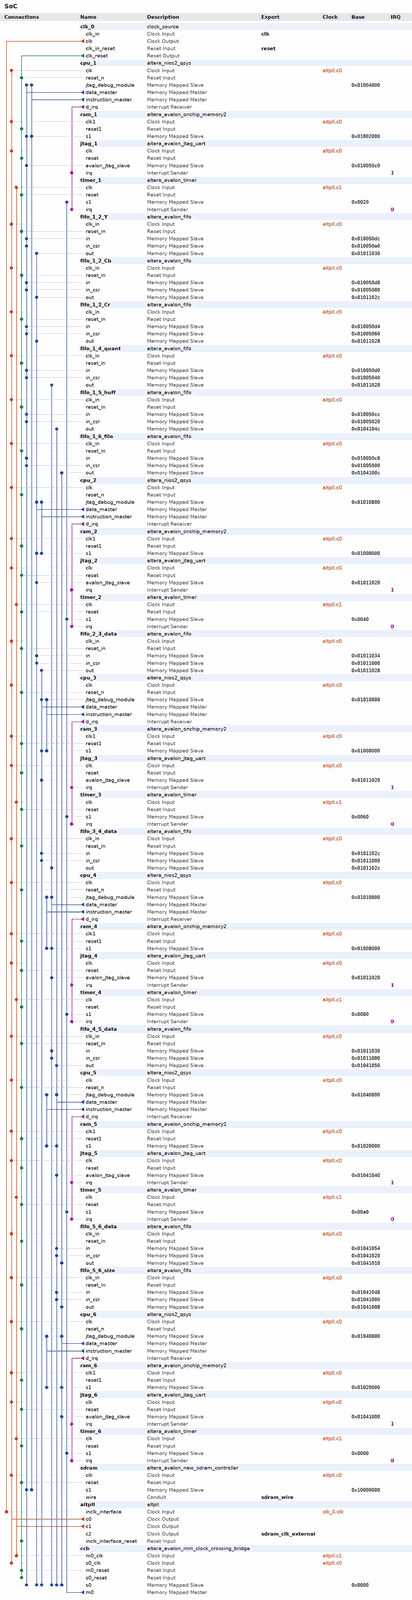
[diagram p0: system contents, whole]
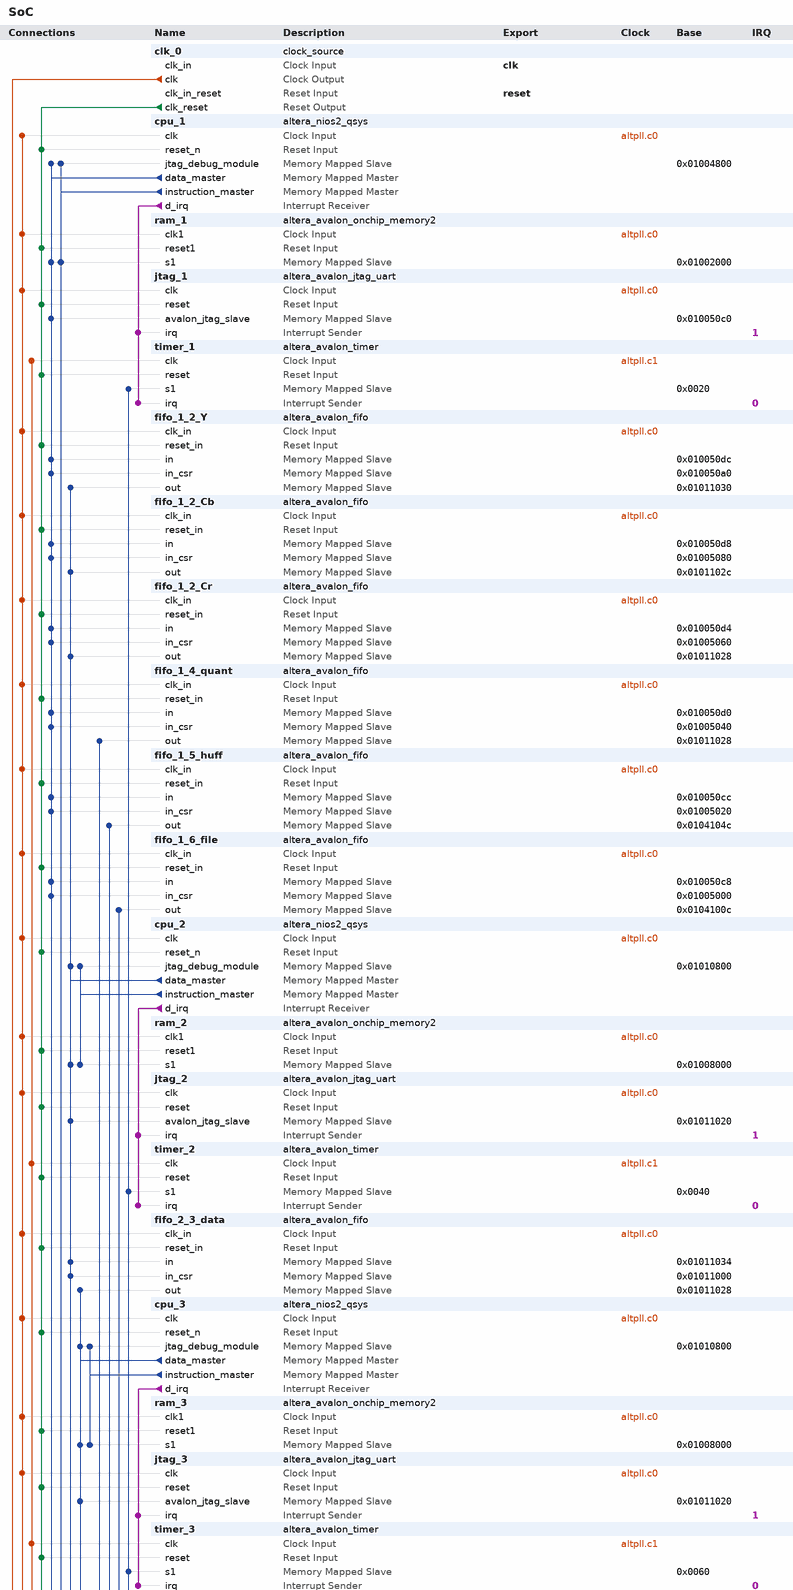
[diagram p1: system contents, upper part]
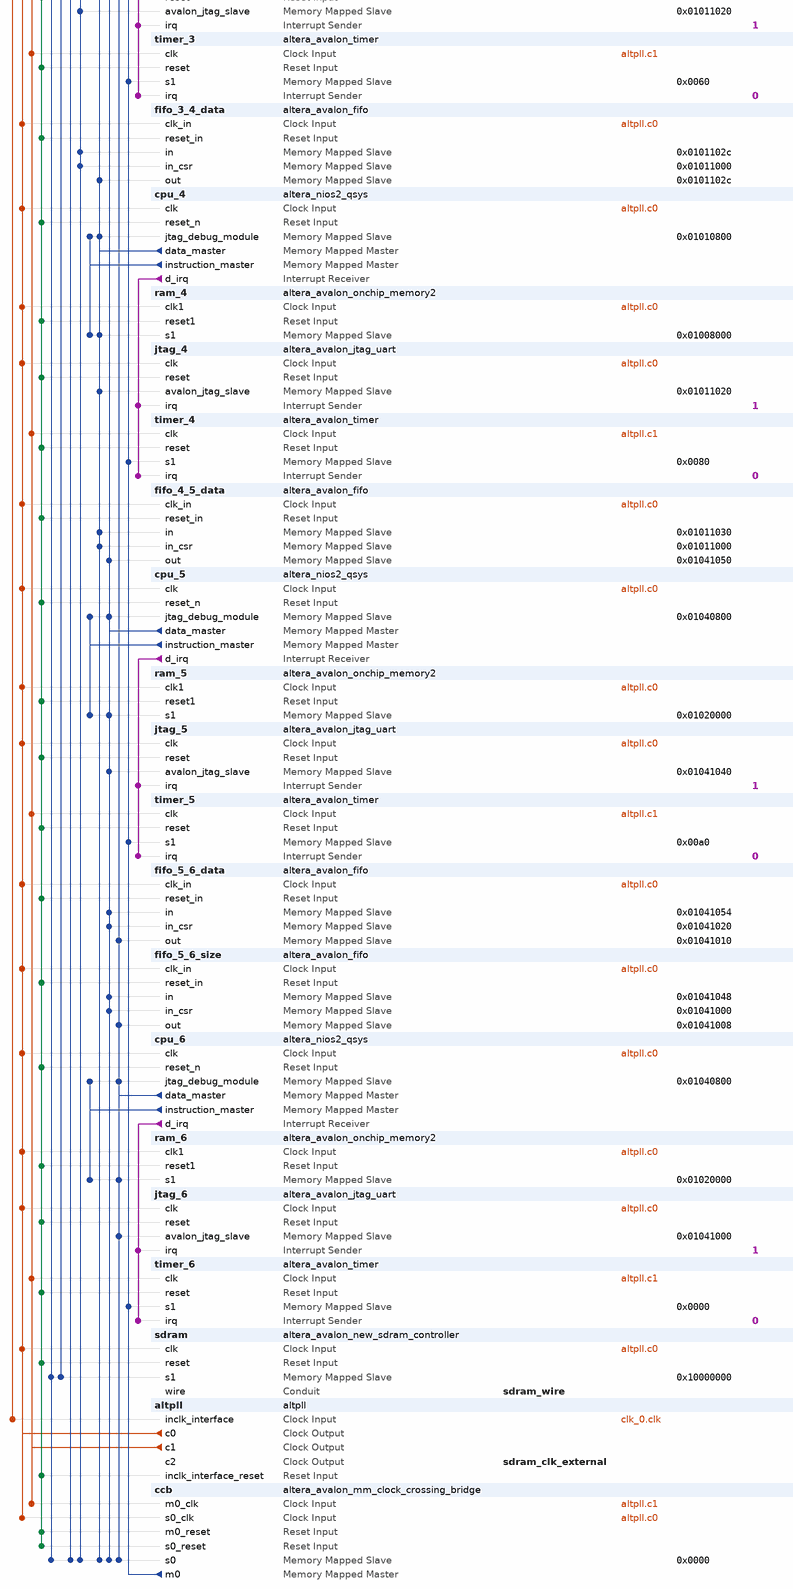
[diagram p2: system contents, lower part]
# Platform Designer (Qsys) system SoC, Cyclone IV E EP4CE115F29C7
# Parameters at their usual value, and those the tool derives, are not listed.
package require -exact qsys 13.1
create_system SoC
set_project_property DEVICE_FAMILY {Cyclone IV E}
set_project_property DEVICE EP4CE115F29C7

add_instance clk_0 clock_source 13.1
set_instance_parameter_value clk_0 clockFrequency 50000000

add_instance cpu_1 altera_nios2_qsys 13.1
set_instance_parameter_value cpu_1 resetSlave sdram.s1
set_instance_parameter_value cpu_1 mmu_TLBMissExcSlave None
set_instance_parameter_value cpu_1 exceptionSlave sdram.s1
set_instance_parameter_value cpu_1 breakSlave cpu_1.jtag_debug_module
set_instance_parameter_value cpu_1 impl Tiny
set_instance_parameter_value cpu_1 icache_size 4096

add_instance ram_1 altera_avalon_onchip_memory2 13.1
set_instance_parameter_value ram_1 dataWidth 32
set_instance_parameter_value ram_1 dualPort false
set_instance_parameter_value ram_1 initMemContent true
set_instance_parameter_value ram_1 initializationFileName onchip_mem.hex
set_instance_parameter_value ram_1 memorySize 8192

add_instance jtag_1 altera_avalon_jtag_uart 13.1
set_instance_parameter_value jtag_1 simInteractiveOptions NO_INTERACTIVE_WINDOWS

add_instance timer_1 altera_avalon_timer 13.1
set_instance_parameter_value timer_1 period 1
set_instance_parameter_value timer_1 periodUnits MSEC

add_instance fifo_1_2_Y altera_avalon_fifo 13.1
set_instance_parameter_value fifo_1_2_Y bitsPerSymbol 16
set_instance_parameter_value fifo_1_2_Y channelWidth 8
set_instance_parameter_value fifo_1_2_Y errorWidth 8
set_instance_parameter_value fifo_1_2_Y fifoDepth 128
set_instance_parameter_value fifo_1_2_Y fifoInputInterfaceOptions AVALONMM_WRITE
set_instance_parameter_value fifo_1_2_Y fifoOutputInterfaceOptions AVALONMM_READ
set_instance_parameter_value fifo_1_2_Y singleClockMode true
set_instance_parameter_value fifo_1_2_Y symbolsPerBeat 2
set_instance_parameter_value fifo_1_2_Y useIRQ false
set_instance_parameter_value fifo_1_2_Y usePacket true
set_instance_parameter_value fifo_1_2_Y useReadControl false

add_instance fifo_1_2_Cb altera_avalon_fifo 13.1
set_instance_parameter_value fifo_1_2_Cb bitsPerSymbol 16
set_instance_parameter_value fifo_1_2_Cb channelWidth 8
set_instance_parameter_value fifo_1_2_Cb errorWidth 8
set_instance_parameter_value fifo_1_2_Cb fifoDepth 128
set_instance_parameter_value fifo_1_2_Cb fifoInputInterfaceOptions AVALONMM_WRITE
set_instance_parameter_value fifo_1_2_Cb fifoOutputInterfaceOptions AVALONMM_READ
set_instance_parameter_value fifo_1_2_Cb singleClockMode true
set_instance_parameter_value fifo_1_2_Cb symbolsPerBeat 2
set_instance_parameter_value fifo_1_2_Cb useIRQ false
set_instance_parameter_value fifo_1_2_Cb usePacket true
set_instance_parameter_value fifo_1_2_Cb useReadControl false

add_instance fifo_1_2_Cr altera_avalon_fifo 13.1
set_instance_parameter_value fifo_1_2_Cr bitsPerSymbol 16
set_instance_parameter_value fifo_1_2_Cr channelWidth 8
set_instance_parameter_value fifo_1_2_Cr errorWidth 8
set_instance_parameter_value fifo_1_2_Cr fifoDepth 128
set_instance_parameter_value fifo_1_2_Cr fifoInputInterfaceOptions AVALONMM_WRITE
set_instance_parameter_value fifo_1_2_Cr fifoOutputInterfaceOptions AVALONMM_READ
set_instance_parameter_value fifo_1_2_Cr singleClockMode true
set_instance_parameter_value fifo_1_2_Cr symbolsPerBeat 2
set_instance_parameter_value fifo_1_2_Cr useIRQ false
set_instance_parameter_value fifo_1_2_Cr usePacket true
set_instance_parameter_value fifo_1_2_Cr useReadControl false

add_instance fifo_1_4_quant altera_avalon_fifo 13.1
set_instance_parameter_value fifo_1_4_quant bitsPerSymbol 16
set_instance_parameter_value fifo_1_4_quant channelWidth 8
set_instance_parameter_value fifo_1_4_quant errorWidth 8
set_instance_parameter_value fifo_1_4_quant fifoDepth 128
set_instance_parameter_value fifo_1_4_quant fifoInputInterfaceOptions AVALONMM_WRITE
set_instance_parameter_value fifo_1_4_quant fifoOutputInterfaceOptions AVALONMM_READ
set_instance_parameter_value fifo_1_4_quant singleClockMode true
set_instance_parameter_value fifo_1_4_quant symbolsPerBeat 2
set_instance_parameter_value fifo_1_4_quant useIRQ false
set_instance_parameter_value fifo_1_4_quant usePacket true
set_instance_parameter_value fifo_1_4_quant useReadControl false

add_instance fifo_1_5_huff altera_avalon_fifo 13.1
set_instance_parameter_value fifo_1_5_huff bitsPerSymbol 16
set_instance_parameter_value fifo_1_5_huff channelWidth 8
set_instance_parameter_value fifo_1_5_huff errorWidth 8
set_instance_parameter_value fifo_1_5_huff fifoDepth 128
set_instance_parameter_value fifo_1_5_huff fifoInputInterfaceOptions AVALONMM_WRITE
set_instance_parameter_value fifo_1_5_huff fifoOutputInterfaceOptions AVALONMM_READ
set_instance_parameter_value fifo_1_5_huff singleClockMode true
set_instance_parameter_value fifo_1_5_huff symbolsPerBeat 2
set_instance_parameter_value fifo_1_5_huff useIRQ false
set_instance_parameter_value fifo_1_5_huff usePacket true
set_instance_parameter_value fifo_1_5_huff useReadControl false

add_instance fifo_1_6_file altera_avalon_fifo 13.1
set_instance_parameter_value fifo_1_6_file bitsPerSymbol 16
set_instance_parameter_value fifo_1_6_file channelWidth 8
set_instance_parameter_value fifo_1_6_file errorWidth 8
set_instance_parameter_value fifo_1_6_file fifoDepth 128
set_instance_parameter_value fifo_1_6_file fifoInputInterfaceOptions AVALONMM_WRITE
set_instance_parameter_value fifo_1_6_file fifoOutputInterfaceOptions AVALONMM_READ
set_instance_parameter_value fifo_1_6_file singleClockMode true
set_instance_parameter_value fifo_1_6_file symbolsPerBeat 2
set_instance_parameter_value fifo_1_6_file useIRQ false
set_instance_parameter_value fifo_1_6_file usePacket true
set_instance_parameter_value fifo_1_6_file useReadControl false

add_instance cpu_2 altera_nios2_qsys 13.1
set_instance_parameter_value cpu_2 resetSlave ram_2.s1
set_instance_parameter_value cpu_2 mmu_TLBMissExcSlave None
set_instance_parameter_value cpu_2 exceptionSlave ram_2.s1
set_instance_parameter_value cpu_2 breakSlave cpu_2.jtag_debug_module
set_instance_parameter_value cpu_2 impl Tiny
set_instance_parameter_value cpu_2 icache_size 4096

add_instance ram_2 altera_avalon_onchip_memory2 13.1
set_instance_parameter_value ram_2 dataWidth 32
set_instance_parameter_value ram_2 dualPort false
set_instance_parameter_value ram_2 initMemContent true
set_instance_parameter_value ram_2 initializationFileName onchip_mem.hex
set_instance_parameter_value ram_2 memorySize 32768

add_instance jtag_2 altera_avalon_jtag_uart 13.1
set_instance_parameter_value jtag_2 simInteractiveOptions NO_INTERACTIVE_WINDOWS

add_instance timer_2 altera_avalon_timer 13.1
set_instance_parameter_value timer_2 period 1
set_instance_parameter_value timer_2 periodUnits MSEC

add_instance fifo_2_3_data altera_avalon_fifo 13.1
set_instance_parameter_value fifo_2_3_data bitsPerSymbol 16
set_instance_parameter_value fifo_2_3_data channelWidth 8
set_instance_parameter_value fifo_2_3_data errorWidth 8
set_instance_parameter_value fifo_2_3_data fifoDepth 128
set_instance_parameter_value fifo_2_3_data fifoInputInterfaceOptions AVALONMM_WRITE
set_instance_parameter_value fifo_2_3_data fifoOutputInterfaceOptions AVALONMM_READ
set_instance_parameter_value fifo_2_3_data singleClockMode true
set_instance_parameter_value fifo_2_3_data symbolsPerBeat 2
set_instance_parameter_value fifo_2_3_data useIRQ false
set_instance_parameter_value fifo_2_3_data usePacket true
set_instance_parameter_value fifo_2_3_data useReadControl false

add_instance cpu_3 altera_nios2_qsys 13.1
set_instance_parameter_value cpu_3 muldiv_divider true
set_instance_parameter_value cpu_3 resetSlave ram_3.s1
set_instance_parameter_value cpu_3 mmu_TLBMissExcSlave None
set_instance_parameter_value cpu_3 exceptionSlave ram_3.s1
set_instance_parameter_value cpu_3 breakSlave cpu_3.jtag_debug_module
set_instance_parameter_value cpu_3 impl Tiny
set_instance_parameter_value cpu_3 icache_size 4096

add_instance ram_3 altera_avalon_onchip_memory2 13.1
set_instance_parameter_value ram_3 dataWidth 32
set_instance_parameter_value ram_3 dualPort false
set_instance_parameter_value ram_3 initMemContent true
set_instance_parameter_value ram_3 initializationFileName onchip_mem.hex
set_instance_parameter_value ram_3 memorySize 32768

add_instance jtag_3 altera_avalon_jtag_uart 13.1
set_instance_parameter_value jtag_3 simInteractiveOptions NO_INTERACTIVE_WINDOWS

add_instance timer_3 altera_avalon_timer 13.1
set_instance_parameter_value timer_3 period 1
set_instance_parameter_value timer_3 periodUnits MSEC

add_instance fifo_3_4_data altera_avalon_fifo 13.1
set_instance_parameter_value fifo_3_4_data bitsPerSymbol 16
set_instance_parameter_value fifo_3_4_data channelWidth 8
set_instance_parameter_value fifo_3_4_data errorWidth 8
set_instance_parameter_value fifo_3_4_data fifoDepth 128
set_instance_parameter_value fifo_3_4_data fifoInputInterfaceOptions AVALONMM_WRITE
set_instance_parameter_value fifo_3_4_data fifoOutputInterfaceOptions AVALONMM_READ
set_instance_parameter_value fifo_3_4_data singleClockMode true
set_instance_parameter_value fifo_3_4_data symbolsPerBeat 2
set_instance_parameter_value fifo_3_4_data useIRQ false
set_instance_parameter_value fifo_3_4_data usePacket true
set_instance_parameter_value fifo_3_4_data useReadControl false

add_instance cpu_4 altera_nios2_qsys 13.1
set_instance_parameter_value cpu_4 muldiv_divider true
set_instance_parameter_value cpu_4 resetSlave ram_4.s1
set_instance_parameter_value cpu_4 mmu_TLBMissExcSlave None
set_instance_parameter_value cpu_4 exceptionSlave ram_4.s1
set_instance_parameter_value cpu_4 breakSlave cpu_4.jtag_debug_module
set_instance_parameter_value cpu_4 impl Tiny
set_instance_parameter_value cpu_4 icache_size 4096

add_instance ram_4 altera_avalon_onchip_memory2 13.1
set_instance_parameter_value ram_4 dataWidth 32
set_instance_parameter_value ram_4 dualPort false
set_instance_parameter_value ram_4 initMemContent true
set_instance_parameter_value ram_4 initializationFileName onchip_mem.hex
set_instance_parameter_value ram_4 memorySize 32768

add_instance jtag_4 altera_avalon_jtag_uart 13.1
set_instance_parameter_value jtag_4 simInteractiveOptions NO_INTERACTIVE_WINDOWS

add_instance timer_4 altera_avalon_timer 13.1
set_instance_parameter_value timer_4 period 1
set_instance_parameter_value timer_4 periodUnits MSEC

add_instance fifo_4_5_data altera_avalon_fifo 13.1
set_instance_parameter_value fifo_4_5_data bitsPerSymbol 16
set_instance_parameter_value fifo_4_5_data channelWidth 8
set_instance_parameter_value fifo_4_5_data errorWidth 8
set_instance_parameter_value fifo_4_5_data fifoDepth 128
set_instance_parameter_value fifo_4_5_data fifoInputInterfaceOptions AVALONMM_WRITE
set_instance_parameter_value fifo_4_5_data fifoOutputInterfaceOptions AVALONMM_READ
set_instance_parameter_value fifo_4_5_data singleClockMode true
set_instance_parameter_value fifo_4_5_data symbolsPerBeat 2
set_instance_parameter_value fifo_4_5_data useIRQ false
set_instance_parameter_value fifo_4_5_data usePacket true
set_instance_parameter_value fifo_4_5_data useReadControl false

add_instance cpu_5 altera_nios2_qsys 13.1
set_instance_parameter_value cpu_5 resetSlave ram_5.s1
set_instance_parameter_value cpu_5 mmu_TLBMissExcSlave None
set_instance_parameter_value cpu_5 exceptionSlave ram_5.s1
set_instance_parameter_value cpu_5 breakSlave cpu_5.jtag_debug_module
set_instance_parameter_value cpu_5 impl Tiny
set_instance_parameter_value cpu_5 icache_size 4096

add_instance ram_5 altera_avalon_onchip_memory2 13.1
set_instance_parameter_value ram_5 dataWidth 32
set_instance_parameter_value ram_5 dualPort false
set_instance_parameter_value ram_5 initMemContent true
set_instance_parameter_value ram_5 initializationFileName onchip_mem.hex
set_instance_parameter_value ram_5 memorySize 131072

add_instance jtag_5 altera_avalon_jtag_uart 13.1
set_instance_parameter_value jtag_5 simInteractiveOptions NO_INTERACTIVE_WINDOWS

add_instance timer_5 altera_avalon_timer 13.1
set_instance_parameter_value timer_5 period 1
set_instance_parameter_value timer_5 periodUnits MSEC

add_instance fifo_5_6_data altera_avalon_fifo 13.1
set_instance_parameter_value fifo_5_6_data bitsPerSymbol 16
set_instance_parameter_value fifo_5_6_data channelWidth 8
set_instance_parameter_value fifo_5_6_data errorWidth 8
set_instance_parameter_value fifo_5_6_data fifoDepth 128
set_instance_parameter_value fifo_5_6_data fifoInputInterfaceOptions AVALONMM_WRITE
set_instance_parameter_value fifo_5_6_data fifoOutputInterfaceOptions AVALONMM_READ
set_instance_parameter_value fifo_5_6_data singleClockMode true
set_instance_parameter_value fifo_5_6_data symbolsPerBeat 2
set_instance_parameter_value fifo_5_6_data useIRQ false
set_instance_parameter_value fifo_5_6_data usePacket true
set_instance_parameter_value fifo_5_6_data useReadControl false

add_instance fifo_5_6_size altera_avalon_fifo 13.1
set_instance_parameter_value fifo_5_6_size bitsPerSymbol 16
set_instance_parameter_value fifo_5_6_size channelWidth 8
set_instance_parameter_value fifo_5_6_size errorWidth 8
set_instance_parameter_value fifo_5_6_size fifoDepth 128
set_instance_parameter_value fifo_5_6_size fifoInputInterfaceOptions AVALONMM_WRITE
set_instance_parameter_value fifo_5_6_size fifoOutputInterfaceOptions AVALONMM_READ
set_instance_parameter_value fifo_5_6_size singleClockMode true
set_instance_parameter_value fifo_5_6_size symbolsPerBeat 2
set_instance_parameter_value fifo_5_6_size useIRQ false
set_instance_parameter_value fifo_5_6_size usePacket true
set_instance_parameter_value fifo_5_6_size useReadControl false

add_instance cpu_6 altera_nios2_qsys 13.1
set_instance_parameter_value cpu_6 resetSlave ram_6.s1
set_instance_parameter_value cpu_6 mmu_TLBMissExcSlave None
set_instance_parameter_value cpu_6 exceptionSlave ram_6.s1
set_instance_parameter_value cpu_6 breakSlave cpu_6.jtag_debug_module
set_instance_parameter_value cpu_6 impl Tiny
set_instance_parameter_value cpu_6 icache_size 4096

add_instance ram_6 altera_avalon_onchip_memory2 13.1
set_instance_parameter_value ram_6 dataWidth 32
set_instance_parameter_value ram_6 dualPort false
set_instance_parameter_value ram_6 initMemContent true
set_instance_parameter_value ram_6 initializationFileName onchip_mem.hex
set_instance_parameter_value ram_6 memorySize 131072

add_instance jtag_6 altera_avalon_jtag_uart 13.1
set_instance_parameter_value jtag_6 simInteractiveOptions NO_INTERACTIVE_WINDOWS

add_instance timer_6 altera_avalon_timer 13.1
set_instance_parameter_value timer_6 period 1
set_instance_parameter_value timer_6 periodUnits MSEC

add_instance sdram altera_avalon_new_sdram_controller 13.1
set_instance_parameter_value sdram TAC 6.0
set_instance_parameter_value sdram TRCD 20.0
set_instance_parameter_value sdram TRP 20.0
set_instance_parameter_value sdram casLatency 3
set_instance_parameter_value sdram columnWidth 10
set_instance_parameter_value sdram dataWidth 32
set_instance_parameter_value sdram generateSimulationModel false
set_instance_parameter_value sdram model single_Micron_MT48LC4M32B2_7_chip
set_instance_parameter_value sdram numberOfBanks 4
set_instance_parameter_value sdram numberOfChipSelects 1
set_instance_parameter_value sdram powerUpDelay 100.0
set_instance_parameter_value sdram refreshPeriod 15.625
set_instance_parameter_value sdram rowWidth 13

add_instance altpll altpll 13.1
set_instance_parameter_value altpll INCLK0_INPUT_FREQUENCY 20000
set_instance_parameter_value altpll CLK0_MULTIPLY_BY 2
set_instance_parameter_value altpll CLK1_MULTIPLY_BY 1
set_instance_parameter_value altpll CLK2_MULTIPLY_BY 2
set_instance_parameter_value altpll CLK0_DIVIDE_BY 1
set_instance_parameter_value altpll CLK1_DIVIDE_BY 5
set_instance_parameter_value altpll CLK2_DIVIDE_BY 1
set_instance_parameter_value altpll CLK1_PHASE_SHIFT 0
set_instance_parameter_value altpll CLK2_PHASE_SHIFT -1806
set_instance_parameter_value altpll CLK1_DUTY_CYCLE 50
set_instance_parameter_value altpll CLK2_DUTY_CYCLE 50
set_instance_parameter_value altpll PORT_clk1 PORT_USED
set_instance_parameter_value altpll PORT_clk2 PORT_USED
set_instance_parameter_value altpll PORT_clk3 PORT_UNUSED
set_instance_parameter_value altpll PORT_ARESET PORT_UNUSED
set_instance_parameter_value altpll PORT_LOCKED PORT_UNUSED

add_instance ccb altera_avalon_mm_clock_crossing_bridge 13.1
set_instance_parameter_value ccb DATA_WIDTH 32
set_instance_parameter_value ccb ADDRESS_WIDTH 16
set_instance_parameter_value ccb MAX_BURST_SIZE 1
set_instance_parameter_value ccb COMMAND_FIFO_DEPTH 4
set_instance_parameter_value ccb RESPONSE_FIFO_DEPTH 4
set_instance_parameter_value ccb MASTER_SYNC_DEPTH 2
set_instance_parameter_value ccb SLAVE_SYNC_DEPTH 2

# connections
add_connection altpll.c0 ccb.s0_clk clock
add_connection altpll.c0 cpu_1.clk clock
add_connection altpll.c0 cpu_2.clk clock
add_connection altpll.c0 cpu_3.clk clock
add_connection altpll.c0 cpu_4.clk clock
add_connection altpll.c0 cpu_5.clk clock
add_connection altpll.c0 cpu_6.clk clock
add_connection altpll.c0 fifo_1_2_Cb.clk_in clock
add_connection altpll.c0 fifo_1_2_Cr.clk_in clock
add_connection altpll.c0 fifo_1_2_Y.clk_in clock
add_connection altpll.c0 fifo_1_4_quant.clk_in clock
add_connection altpll.c0 fifo_1_5_huff.clk_in clock
add_connection altpll.c0 fifo_1_6_file.clk_in clock
add_connection altpll.c0 fifo_2_3_data.clk_in clock
add_connection altpll.c0 fifo_3_4_data.clk_in clock
add_connection altpll.c0 fifo_4_5_data.clk_in clock
add_connection altpll.c0 fifo_5_6_data.clk_in clock
add_connection altpll.c0 fifo_5_6_size.clk_in clock
add_connection altpll.c0 jtag_1.clk clock
add_connection altpll.c0 jtag_2.clk clock
add_connection altpll.c0 jtag_3.clk clock
add_connection altpll.c0 jtag_4.clk clock
add_connection altpll.c0 jtag_5.clk clock
add_connection altpll.c0 jtag_6.clk clock
add_connection altpll.c0 ram_1.clk1 clock
add_connection altpll.c0 ram_2.clk1 clock
add_connection altpll.c0 ram_3.clk1 clock
add_connection altpll.c0 ram_4.clk1 clock
add_connection altpll.c0 ram_5.clk1 clock
add_connection altpll.c0 ram_6.clk1 clock
add_connection altpll.c0 sdram.clk clock
add_connection altpll.c1 ccb.m0_clk clock
add_connection altpll.c1 timer_1.clk clock
add_connection altpll.c1 timer_2.clk clock
add_connection altpll.c1 timer_3.clk clock
add_connection altpll.c1 timer_4.clk clock
add_connection altpll.c1 timer_5.clk clock
add_connection altpll.c1 timer_6.clk clock
add_connection clk_0.clk altpll.inclk_interface clock
add_connection clk_0.clk_reset altpll.inclk_interface_reset reset
add_connection clk_0.clk_reset ccb.m0_reset reset
add_connection clk_0.clk_reset ccb.s0_reset reset
add_connection clk_0.clk_reset cpu_1.reset_n reset
add_connection clk_0.clk_reset cpu_2.reset_n reset
add_connection clk_0.clk_reset cpu_3.reset_n reset
add_connection clk_0.clk_reset cpu_4.reset_n reset
add_connection clk_0.clk_reset cpu_5.reset_n reset
add_connection clk_0.clk_reset cpu_6.reset_n reset
add_connection clk_0.clk_reset fifo_1_2_Cb.reset_in reset
add_connection clk_0.clk_reset fifo_1_2_Cr.reset_in reset
add_connection clk_0.clk_reset fifo_1_2_Y.reset_in reset
add_connection clk_0.clk_reset fifo_1_4_quant.reset_in reset
add_connection clk_0.clk_reset fifo_1_5_huff.reset_in reset
add_connection clk_0.clk_reset fifo_1_6_file.reset_in reset
add_connection clk_0.clk_reset fifo_2_3_data.reset_in reset
add_connection clk_0.clk_reset fifo_3_4_data.reset_in reset
add_connection clk_0.clk_reset fifo_4_5_data.reset_in reset
add_connection clk_0.clk_reset fifo_5_6_data.reset_in reset
add_connection clk_0.clk_reset fifo_5_6_size.reset_in reset
add_connection clk_0.clk_reset jtag_1.reset reset
add_connection clk_0.clk_reset jtag_2.reset reset
add_connection clk_0.clk_reset jtag_3.reset reset
add_connection clk_0.clk_reset jtag_4.reset reset
add_connection clk_0.clk_reset jtag_5.reset reset
add_connection clk_0.clk_reset jtag_6.reset reset
add_connection clk_0.clk_reset ram_1.reset1 reset
add_connection clk_0.clk_reset ram_2.reset1 reset
add_connection clk_0.clk_reset ram_3.reset1 reset
add_connection clk_0.clk_reset ram_4.reset1 reset
add_connection clk_0.clk_reset ram_5.reset1 reset
add_connection clk_0.clk_reset ram_6.reset1 reset
add_connection clk_0.clk_reset sdram.reset reset
add_connection clk_0.clk_reset timer_1.reset reset
add_connection clk_0.clk_reset timer_2.reset reset
add_connection clk_0.clk_reset timer_3.reset reset
add_connection clk_0.clk_reset timer_4.reset reset
add_connection clk_0.clk_reset timer_5.reset reset
add_connection clk_0.clk_reset timer_6.reset reset
add_connection ccb.m0 timer_1.s1 avalon
set_connection_parameter_value ccb.m0/timer_1.s1 baseAddress 0x0020
add_connection ccb.m0 timer_2.s1 avalon
set_connection_parameter_value ccb.m0/timer_2.s1 baseAddress 0x0040
add_connection ccb.m0 timer_3.s1 avalon
set_connection_parameter_value ccb.m0/timer_3.s1 baseAddress 0x0060
add_connection ccb.m0 timer_4.s1 avalon
set_connection_parameter_value ccb.m0/timer_4.s1 baseAddress 0x0080
add_connection ccb.m0 timer_5.s1 avalon
set_connection_parameter_value ccb.m0/timer_5.s1 baseAddress 0x00a0
add_connection ccb.m0 timer_6.s1 avalon
set_connection_parameter_value ccb.m0/timer_6.s1 baseAddress 0x0000
add_connection cpu_1.data_master ccb.s0 avalon
set_connection_parameter_value cpu_1.data_master/ccb.s0 baseAddress 0x0000
add_connection cpu_1.data_master cpu_1.jtag_debug_module avalon
set_connection_parameter_value cpu_1.data_master/cpu_1.jtag_debug_module baseAddress 0x01004800
add_connection cpu_1.data_master fifo_1_2_Cb.in avalon
set_connection_parameter_value cpu_1.data_master/fifo_1_2_Cb.in baseAddress 0x010050d8
add_connection cpu_1.data_master fifo_1_2_Cb.in_csr avalon
set_connection_parameter_value cpu_1.data_master/fifo_1_2_Cb.in_csr baseAddress 0x01005080
add_connection cpu_1.data_master fifo_1_2_Cr.in avalon
set_connection_parameter_value cpu_1.data_master/fifo_1_2_Cr.in baseAddress 0x010050d4
add_connection cpu_1.data_master fifo_1_2_Cr.in_csr avalon
set_connection_parameter_value cpu_1.data_master/fifo_1_2_Cr.in_csr baseAddress 0x01005060
add_connection cpu_1.data_master fifo_1_2_Y.in avalon
set_connection_parameter_value cpu_1.data_master/fifo_1_2_Y.in baseAddress 0x010050dc
add_connection cpu_1.data_master fifo_1_2_Y.in_csr avalon
set_connection_parameter_value cpu_1.data_master/fifo_1_2_Y.in_csr baseAddress 0x010050a0
add_connection cpu_1.data_master fifo_1_4_quant.in avalon
set_connection_parameter_value cpu_1.data_master/fifo_1_4_quant.in baseAddress 0x010050d0
add_connection cpu_1.data_master fifo_1_4_quant.in_csr avalon
set_connection_parameter_value cpu_1.data_master/fifo_1_4_quant.in_csr baseAddress 0x01005040
add_connection cpu_1.data_master fifo_1_5_huff.in avalon
set_connection_parameter_value cpu_1.data_master/fifo_1_5_huff.in baseAddress 0x010050cc
add_connection cpu_1.data_master fifo_1_5_huff.in_csr avalon
set_connection_parameter_value cpu_1.data_master/fifo_1_5_huff.in_csr baseAddress 0x01005020
add_connection cpu_1.data_master fifo_1_6_file.in avalon
set_connection_parameter_value cpu_1.data_master/fifo_1_6_file.in baseAddress 0x010050c8
add_connection cpu_1.data_master fifo_1_6_file.in_csr avalon
set_connection_parameter_value cpu_1.data_master/fifo_1_6_file.in_csr baseAddress 0x01005000
add_connection cpu_1.data_master jtag_1.avalon_jtag_slave avalon
set_connection_parameter_value cpu_1.data_master/jtag_1.avalon_jtag_slave baseAddress 0x010050c0
add_connection cpu_1.data_master ram_1.s1 avalon
set_connection_parameter_value cpu_1.data_master/ram_1.s1 baseAddress 0x01002000
add_connection cpu_1.data_master sdram.s1 avalon
set_connection_parameter_value cpu_1.data_master/sdram.s1 baseAddress 0x10000000
add_connection cpu_1.instruction_master cpu_1.jtag_debug_module avalon
set_connection_parameter_value cpu_1.instruction_master/cpu_1.jtag_debug_module baseAddress 0x01004800
add_connection cpu_1.instruction_master ram_1.s1 avalon
set_connection_parameter_value cpu_1.instruction_master/ram_1.s1 baseAddress 0x01002000
add_connection cpu_1.instruction_master sdram.s1 avalon
set_connection_parameter_value cpu_1.instruction_master/sdram.s1 baseAddress 0x10000000
add_connection cpu_2.data_master ccb.s0 avalon
set_connection_parameter_value cpu_2.data_master/ccb.s0 baseAddress 0x0000
add_connection cpu_2.data_master cpu_2.jtag_debug_module avalon
set_connection_parameter_value cpu_2.data_master/cpu_2.jtag_debug_module baseAddress 0x01010800
add_connection cpu_2.data_master fifo_1_2_Cb.out avalon
set_connection_parameter_value cpu_2.data_master/fifo_1_2_Cb.out baseAddress 0x0101102c
add_connection cpu_2.data_master fifo_1_2_Cr.out avalon
set_connection_parameter_value cpu_2.data_master/fifo_1_2_Cr.out baseAddress 0x01011028
add_connection cpu_2.data_master fifo_1_2_Y.out avalon
set_connection_parameter_value cpu_2.data_master/fifo_1_2_Y.out baseAddress 0x01011030
add_connection cpu_2.data_master fifo_2_3_data.in avalon
set_connection_parameter_value cpu_2.data_master/fifo_2_3_data.in baseAddress 0x01011034
add_connection cpu_2.data_master fifo_2_3_data.in_csr avalon
set_connection_parameter_value cpu_2.data_master/fifo_2_3_data.in_csr baseAddress 0x01011000
add_connection cpu_2.data_master jtag_2.avalon_jtag_slave avalon
set_connection_parameter_value cpu_2.data_master/jtag_2.avalon_jtag_slave baseAddress 0x01011020
add_connection cpu_2.data_master ram_2.s1 avalon
set_connection_parameter_value cpu_2.data_master/ram_2.s1 baseAddress 0x01008000
add_connection cpu_2.instruction_master cpu_2.jtag_debug_module avalon
set_connection_parameter_value cpu_2.instruction_master/cpu_2.jtag_debug_module baseAddress 0x01010800
add_connection cpu_2.instruction_master ram_2.s1 avalon
set_connection_parameter_value cpu_2.instruction_master/ram_2.s1 baseAddress 0x01008000
add_connection cpu_3.data_master ccb.s0 avalon
set_connection_parameter_value cpu_3.data_master/ccb.s0 baseAddress 0x0000
add_connection cpu_3.data_master cpu_3.jtag_debug_module avalon
set_connection_parameter_value cpu_3.data_master/cpu_3.jtag_debug_module baseAddress 0x01010800
add_connection cpu_3.data_master fifo_2_3_data.out avalon
set_connection_parameter_value cpu_3.data_master/fifo_2_3_data.out baseAddress 0x01011028
add_connection cpu_3.data_master fifo_3_4_data.in avalon
set_connection_parameter_value cpu_3.data_master/fifo_3_4_data.in baseAddress 0x0101102c
add_connection cpu_3.data_master fifo_3_4_data.in_csr avalon
set_connection_parameter_value cpu_3.data_master/fifo_3_4_data.in_csr baseAddress 0x01011000
add_connection cpu_3.data_master jtag_3.avalon_jtag_slave avalon
set_connection_parameter_value cpu_3.data_master/jtag_3.avalon_jtag_slave baseAddress 0x01011020
add_connection cpu_3.data_master ram_3.s1 avalon
set_connection_parameter_value cpu_3.data_master/ram_3.s1 baseAddress 0x01008000
add_connection cpu_3.instruction_master cpu_3.jtag_debug_module avalon
set_connection_parameter_value cpu_3.instruction_master/cpu_3.jtag_debug_module baseAddress 0x01010800
add_connection cpu_3.instruction_master ram_3.s1 avalon
set_connection_parameter_value cpu_3.instruction_master/ram_3.s1 baseAddress 0x01008000
add_connection cpu_4.data_master ccb.s0 avalon
set_connection_parameter_value cpu_4.data_master/ccb.s0 baseAddress 0x0000
add_connection cpu_4.data_master cpu_4.jtag_debug_module avalon
set_connection_parameter_value cpu_4.data_master/cpu_4.jtag_debug_module baseAddress 0x01010800
add_connection cpu_4.data_master fifo_1_4_quant.out avalon
set_connection_parameter_value cpu_4.data_master/fifo_1_4_quant.out baseAddress 0x01011028
add_connection cpu_4.data_master fifo_3_4_data.out avalon
set_connection_parameter_value cpu_4.data_master/fifo_3_4_data.out baseAddress 0x0101102c
add_connection cpu_4.data_master fifo_4_5_data.in avalon
set_connection_parameter_value cpu_4.data_master/fifo_4_5_data.in baseAddress 0x01011030
add_connection cpu_4.data_master fifo_4_5_data.in_csr avalon
set_connection_parameter_value cpu_4.data_master/fifo_4_5_data.in_csr baseAddress 0x01011000
add_connection cpu_4.data_master jtag_4.avalon_jtag_slave avalon
set_connection_parameter_value cpu_4.data_master/jtag_4.avalon_jtag_slave baseAddress 0x01011020
add_connection cpu_4.data_master ram_4.s1 avalon
set_connection_parameter_value cpu_4.data_master/ram_4.s1 baseAddress 0x01008000
add_connection cpu_4.instruction_master cpu_4.jtag_debug_module avalon
set_connection_parameter_value cpu_4.instruction_master/cpu_4.jtag_debug_module baseAddress 0x01010800
add_connection cpu_4.instruction_master ram_4.s1 avalon
set_connection_parameter_value cpu_4.instruction_master/ram_4.s1 baseAddress 0x01008000
add_connection cpu_5.data_master ccb.s0 avalon
set_connection_parameter_value cpu_5.data_master/ccb.s0 baseAddress 0x0000
add_connection cpu_5.data_master cpu_5.jtag_debug_module avalon
set_connection_parameter_value cpu_5.data_master/cpu_5.jtag_debug_module baseAddress 0x01040800
add_connection cpu_5.data_master fifo_1_5_huff.out avalon
set_connection_parameter_value cpu_5.data_master/fifo_1_5_huff.out baseAddress 0x0104104c
add_connection cpu_5.data_master fifo_4_5_data.out avalon
set_connection_parameter_value cpu_5.data_master/fifo_4_5_data.out baseAddress 0x01041050
add_connection cpu_5.data_master fifo_5_6_data.in avalon
set_connection_parameter_value cpu_5.data_master/fifo_5_6_data.in baseAddress 0x01041054
add_connection cpu_5.data_master fifo_5_6_data.in_csr avalon
set_connection_parameter_value cpu_5.data_master/fifo_5_6_data.in_csr baseAddress 0x01041020
add_connection cpu_5.data_master fifo_5_6_size.in avalon
set_connection_parameter_value cpu_5.data_master/fifo_5_6_size.in baseAddress 0x01041048
add_connection cpu_5.data_master fifo_5_6_size.in_csr avalon
set_connection_parameter_value cpu_5.data_master/fifo_5_6_size.in_csr baseAddress 0x01041000
add_connection cpu_5.data_master jtag_5.avalon_jtag_slave avalon
set_connection_parameter_value cpu_5.data_master/jtag_5.avalon_jtag_slave baseAddress 0x01041040
add_connection cpu_5.data_master ram_5.s1 avalon
set_connection_parameter_value cpu_5.data_master/ram_5.s1 baseAddress 0x01020000
add_connection cpu_5.instruction_master cpu_5.jtag_debug_module avalon
set_connection_parameter_value cpu_5.instruction_master/cpu_5.jtag_debug_module baseAddress 0x01040800
add_connection cpu_5.instruction_master ram_5.s1 avalon
set_connection_parameter_value cpu_5.instruction_master/ram_5.s1 baseAddress 0x01020000
add_connection cpu_6.data_master ccb.s0 avalon
set_connection_parameter_value cpu_6.data_master/ccb.s0 baseAddress 0x0000
add_connection cpu_6.data_master cpu_6.jtag_debug_module avalon
set_connection_parameter_value cpu_6.data_master/cpu_6.jtag_debug_module baseAddress 0x01040800
add_connection cpu_6.data_master fifo_1_6_file.out avalon
set_connection_parameter_value cpu_6.data_master/fifo_1_6_file.out baseAddress 0x0104100c
add_connection cpu_6.data_master fifo_5_6_data.out avalon
set_connection_parameter_value cpu_6.data_master/fifo_5_6_data.out baseAddress 0x01041010
add_connection cpu_6.data_master fifo_5_6_size.out avalon
set_connection_parameter_value cpu_6.data_master/fifo_5_6_size.out baseAddress 0x01041008
add_connection cpu_6.data_master jtag_6.avalon_jtag_slave avalon
set_connection_parameter_value cpu_6.data_master/jtag_6.avalon_jtag_slave baseAddress 0x01041000
add_connection cpu_6.data_master ram_6.s1 avalon
set_connection_parameter_value cpu_6.data_master/ram_6.s1 baseAddress 0x01020000
add_connection cpu_6.instruction_master cpu_6.jtag_debug_module avalon
set_connection_parameter_value cpu_6.instruction_master/cpu_6.jtag_debug_module baseAddress 0x01040800
add_connection cpu_6.instruction_master ram_6.s1 avalon
set_connection_parameter_value cpu_6.instruction_master/ram_6.s1 baseAddress 0x01020000
add_connection cpu_1.d_irq jtag_1.irq interrupt
set_connection_parameter_value cpu_1.d_irq/jtag_1.irq irqNumber 1
add_connection cpu_1.d_irq timer_1.irq interrupt
set_connection_parameter_value cpu_1.d_irq/timer_1.irq irqNumber 0
add_connection cpu_2.d_irq jtag_2.irq interrupt
set_connection_parameter_value cpu_2.d_irq/jtag_2.irq irqNumber 1
add_connection cpu_2.d_irq timer_2.irq interrupt
set_connection_parameter_value cpu_2.d_irq/timer_2.irq irqNumber 0
add_connection cpu_3.d_irq jtag_3.irq interrupt
set_connection_parameter_value cpu_3.d_irq/jtag_3.irq irqNumber 1
add_connection cpu_3.d_irq timer_3.irq interrupt
set_connection_parameter_value cpu_3.d_irq/timer_3.irq irqNumber 0
add_connection cpu_4.d_irq jtag_4.irq interrupt
set_connection_parameter_value cpu_4.d_irq/jtag_4.irq irqNumber 1
add_connection cpu_4.d_irq timer_4.irq interrupt
set_connection_parameter_value cpu_4.d_irq/timer_4.irq irqNumber 0
add_connection cpu_5.d_irq jtag_5.irq interrupt
set_connection_parameter_value cpu_5.d_irq/jtag_5.irq irqNumber 1
add_connection cpu_5.d_irq timer_5.irq interrupt
set_connection_parameter_value cpu_5.d_irq/timer_5.irq irqNumber 0
add_connection cpu_6.d_irq jtag_6.irq interrupt
set_connection_parameter_value cpu_6.d_irq/jtag_6.irq irqNumber 1
add_connection cpu_6.d_irq timer_6.irq interrupt
set_connection_parameter_value cpu_6.d_irq/timer_6.irq irqNumber 0

# exported interfaces
add_interface clk clock sink
set_interface_property clk EXPORT_OF clk_0.clk_in
add_interface reset reset sink
set_interface_property reset EXPORT_OF clk_0.clk_in_reset
add_interface sdram_wire conduit end
set_interface_property sdram_wire EXPORT_OF sdram.wire
add_interface sdram_clk_external clock source
set_interface_property sdram_clk_external EXPORT_OF altpll.c2

set_interconnect_requirement {$system} qsys_mm.clockCrossingAdapter HANDSHAKE
set_interconnect_requirement {$system} qsys_mm.maxAdditionalLatency 1
set_interconnect_requirement {$system} qsys_mm.insertDefaultSlave false

save_system SoC.qsys
